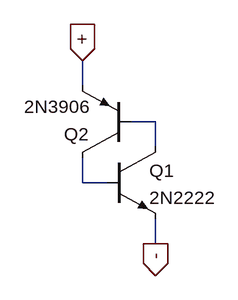
[diagram p0: schematic d30703bx.asc]
d30703bx.asc, the LTspice schematic file:
Version 4
SHEET 1 880 680
WIRE -32 160 -32 128
WIRE 64 208 32 208
WIRE 64 240 64 208
WIRE -32 288 -32 256
WIRE 0 288 -32 288
WIRE 64 368 64 336
FLAG -32 128 +
IOPIN -32 128 In
FLAG 64 368 -
IOPIN 64 368 Out
SYMBOL npn 0 240 R0
SYMATTR InstName Q1
SYMATTR Value 2N2222
SYMBOL pnp 32 256 R180
SYMATTR InstName Q2
SYMATTR Value 2N3906

The netlist it stands for:
* d30703bx.asc
Q1 N001 N002 - 0 2N2222
Q2 N002 N001 + 0 2N3906
.model NPN NPN
.model PNP PNP
.lib standard.bjt
.backanno
.end